# Altium schematic sheet F280025C_min_sys.SchDoc
size A3; SheetNumber: 1; SheetTotal: 2
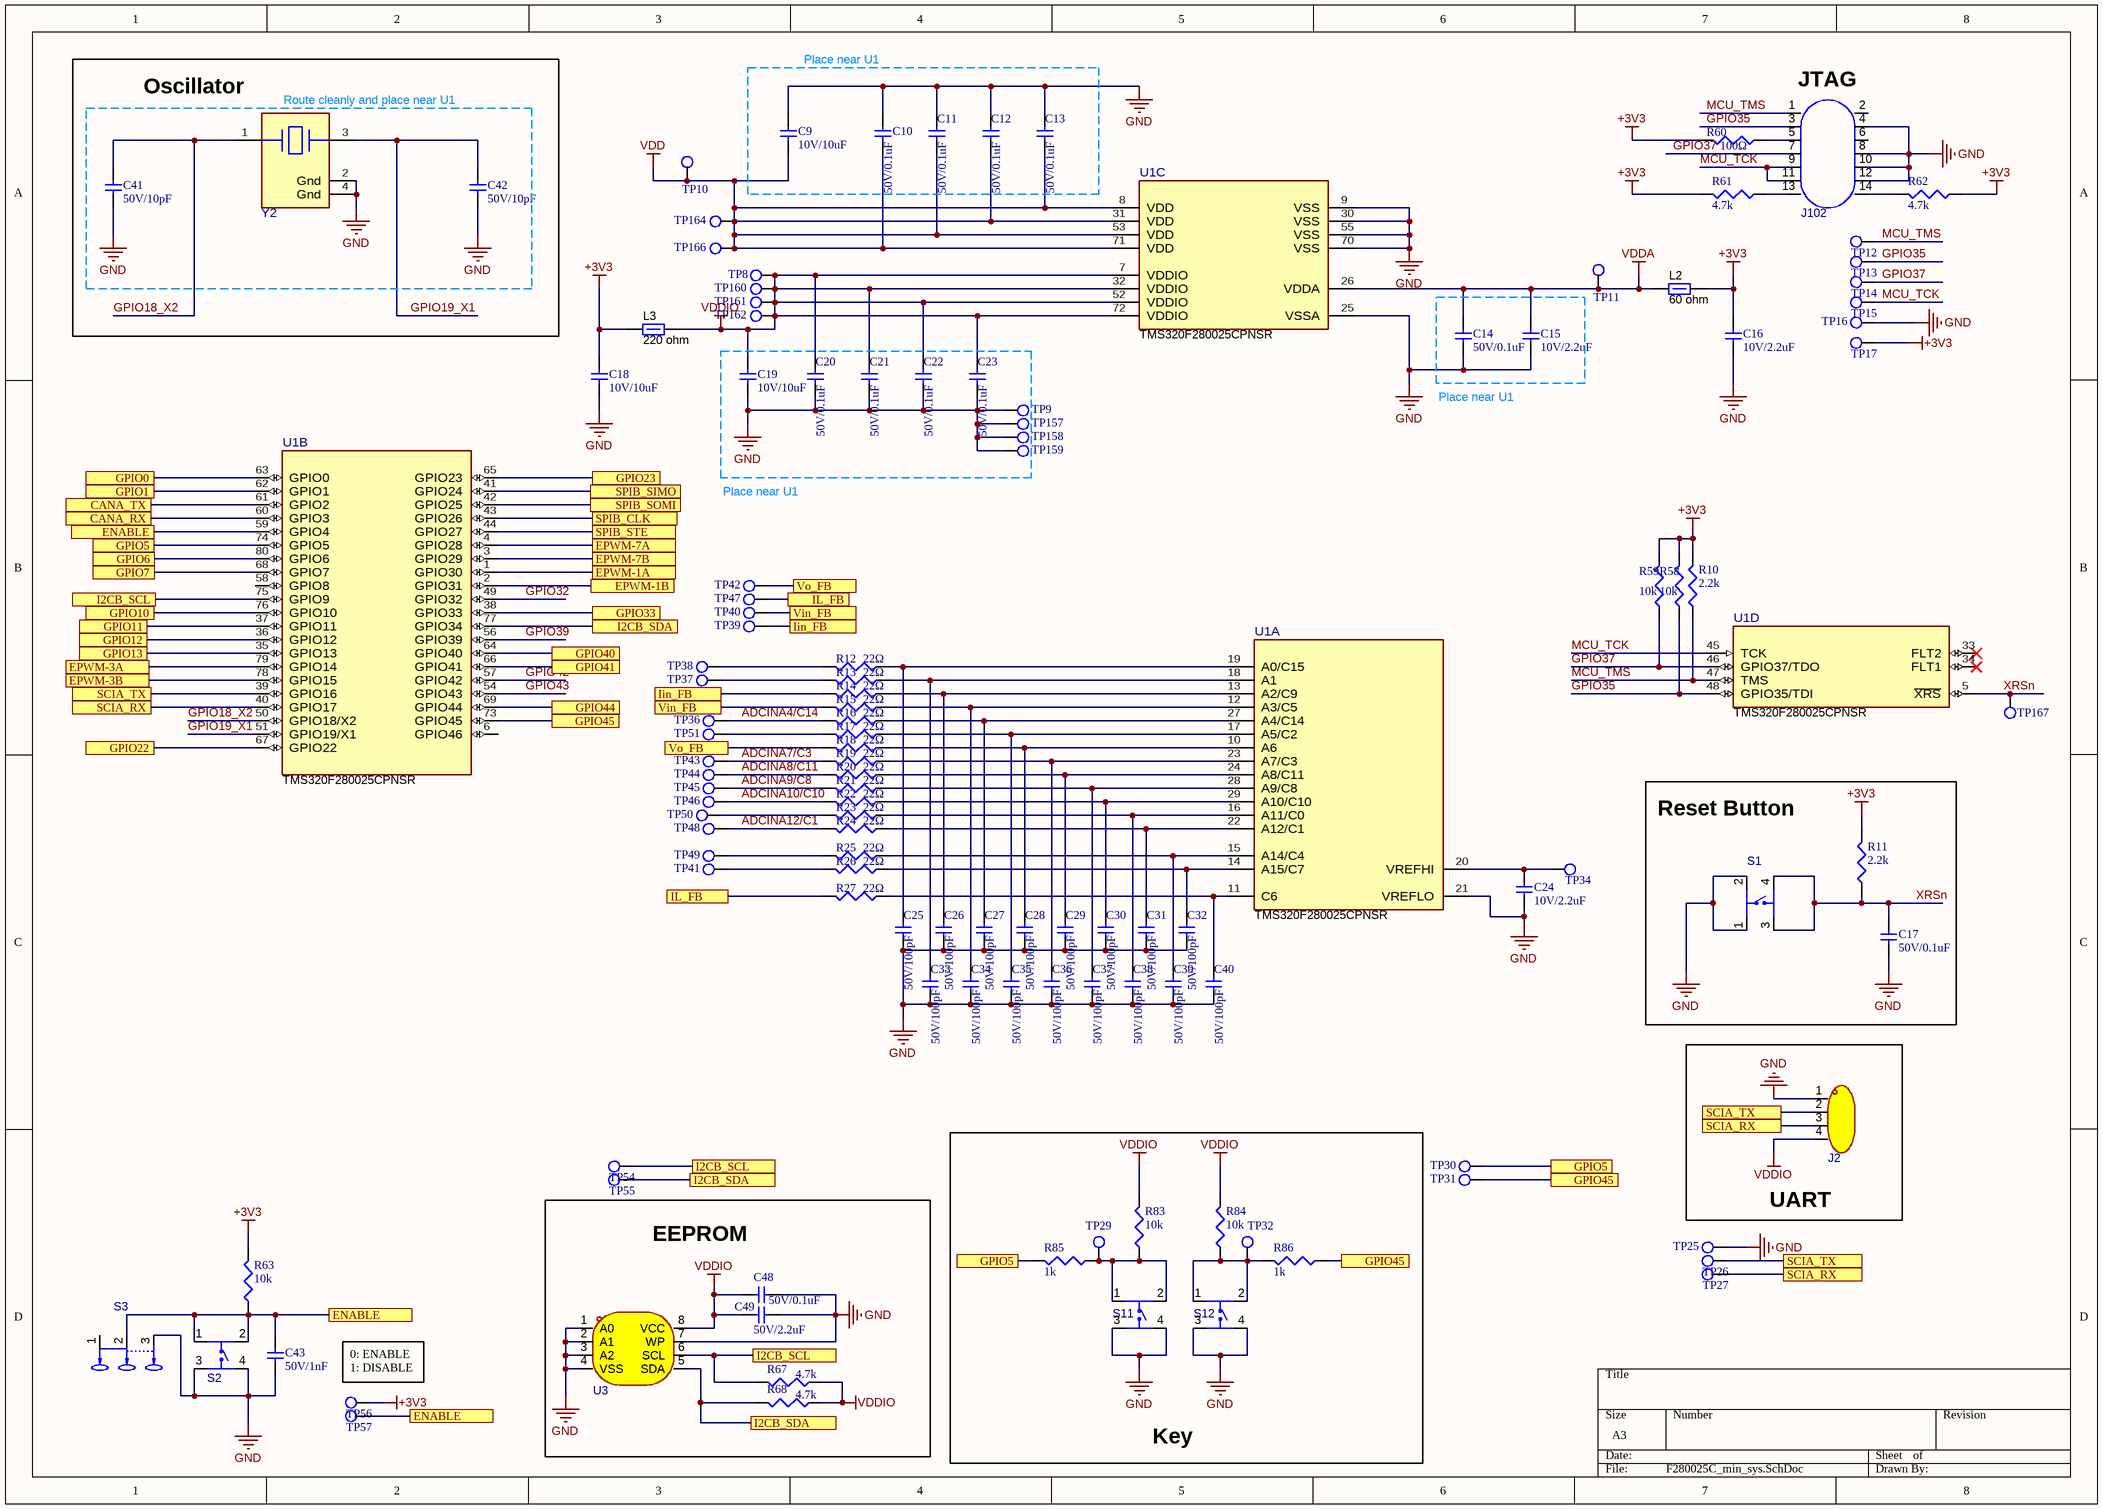
[diagram p0: F280025C_min_sys.SchDoc]

## Parts
C9  10V/10uF  [C0603]
C10  50V/0.1uF  [C0603]
C11  50V/0.1uF  [C0603]
C12  50V/0.1uF  [C0603]
C13  50V/0.1uF  [C0603]
C14  50V/0.1uF  [C0603]
C15  10V/2.2uF  [C0603]
C16  10V/2.2uF  [C0603]
C17  50V/0.1uF  [C0603]
C18  10V/10uF  [C0603]
C19  10V/10uF  [C0603]
C20  50V/0.1uF  [C0603]
C21  50V/0.1uF  [C0603]
C22  50V/0.1uF  [C0603]
C23  50V/0.1uF  [C0603]
C24  10V/2.2uF  [C0603]
C25  50V/100pF  [C0603]
C26  50V/100pF  [C0603]
C27  50V/100pF  [C0603]
C28  50V/100pF  [C0603]
C29  50V/100pF  [C0603]
C30  50V/100pF  [C0603]
C31  50V/100pF  [C0603]
C32  50V/100pF  [C0603]
C33  50V/100pF  [C0603]
C34  50V/100pF  [C0603]
C35  50V/100pF  [C0603]
C36  50V/100pF  [C0603]
C37  50V/100pF  [C0603]
C38  50V/100pF  [C0603]
C39  50V/100pF  [C0603]
C40  50V/100pF  [C0603]
C41  50V/10pF  [C0603]
C42  50V/10pF  [C0603]
C43  50V/1nF  [C0603]
C48  50V/0.1uF  [C0603]
C49  50V/2.2uF  [C0805]
J2  pz254v-11-04p  [HDR-TH_4P-P2.54-V-M]  (value not drawn)
J102  2.54-2*7p简牛  [IDC-TH_14P-P2.54-V-R2-C7-S2.54]  (value not drawn)
L2  value 60 ohm  [L0805]  (hidden comment: 60Ω@100MHz)
L3  ValueDisplayed: 220 ohm  [L0805]  (hidden comment: 220Ω/100 MHz)
R10  2.2k  [R0603]
R11  2.2k  [R0603]
R12  22Ω  [R0603]
R13  22Ω  [R0603]
R14  22Ω  [R0603]
R15  22Ω  [R0603]
R16  22Ω  [R0603]
R17  22Ω  [R0603]
R18  22Ω  [R0603]
R19  22Ω  [R0603]
R20  22Ω  [R0603]
R21  22Ω  [R0603]
R22  22Ω  [R0603]
R23  22Ω  [R0603]
R24  22Ω  [R0603]
R25  22Ω  [R0603]
R26  22Ω  [R0603]
R27  22Ω  [R0603]
R58  10k  [R0603]
R59  10k  [R0603]
R60  100Ω  [R0603]
R61  4.7k  [R0603]
R62  4.7k  [R0603]
R63  10k  [R0603]
R67  4.7k  [R0603]
R68  4.7k  [R0603]
R83  10k  [R0603]
R84  10k  [R0603]
R85  1k  [R0603]
R86  1k  [R0603]
S1  kh-6x6x5h-stm  [SW-SMD_4P-L6.0-W6.0-P4.50-LS9.0_H5.0]  (value not drawn)
S2  kh-6x6x5h-stm  [SW-SMD_4P-L6.0-W6.0-P4.50-LS9.0_H5.0]  (value not drawn)
S3  ss-12d10l5  [SW-TH_SS-12D10L5]  (value not drawn)
S11  kh-6x6x5h-stm  [SW-SMD_4P-L6.0-W6.0-P4.50-LS9.0_H5.0]  (value not drawn)
S12  kh-6x6x5h-stm  [SW-SMD_4P-L6.0-W6.0-P4.50-LS9.0_H5.0]  (value not drawn)
TP8  TEST POINT  [TP-1.5]  (value not drawn)
TP9  TP-pad0.8  [PAD0.8/1.6]  (value not drawn)
TP10  TEST POINT  [TP-1.5]  (value not drawn)
TP11  TEST POINT  [TP-1.5]  (value not drawn)
TP12  TEST POINT  [TP-1.5]  (value not drawn)
TP13  TEST POINT  [TP-1.5]  (value not drawn)
TP14  TEST POINT  [TP-1.5]  (value not drawn)
TP15  TEST POINT  [TP-1.5]  (value not drawn)
TP16  TP-pad0.8  [PAD0.8/1.6]  (value not drawn)
TP17  TEST POINT  [TP-1.5]  (value not drawn)
TP25  TP-pad0.8  [PAD0.8/1.6]  (value not drawn)
TP26  TEST POINT  [TP-1.5]  (value not drawn)
TP27  TEST POINT  [TP-1.5]  (value not drawn)
TP29  TEST POINT  [TP-1.5]  (value not drawn)
TP30  TEST POINT  [TP-1.5]  (value not drawn)
TP31  TEST POINT  [TP-1.5]  (value not drawn)
TP32  TEST POINT  [TP-1.5]  (value not drawn)
TP34  TEST POINT  [TP-1.5]  (value not drawn)
TP36  TP-pad0.8  [PAD0.8/1.6]  (value not drawn)
TP37  TP-pad0.8  [PAD0.8/1.6]  (value not drawn)
TP38  TP-pad0.8  [PAD0.8/1.6]  (value not drawn)
TP39  TP-pad0.8  [PAD0.8/1.6]  (value not drawn)
TP40  TP-pad0.8  [PAD0.8/1.6]  (value not drawn)
TP41  TP-pad0.8  [PAD0.8/1.6]  (value not drawn)
TP42  TP-pad0.8  [PAD0.8/1.6]  (value not drawn)
TP43  TP-pad0.8  [PAD0.8/1.6]  (value not drawn)
TP44  TP-pad0.8  [PAD0.8/1.6]  (value not drawn)
TP45  TP-pad0.8  [PAD0.8/1.6]  (value not drawn)
TP46  TP-pad0.8  [PAD0.8/1.6]  (value not drawn)
TP47  TP-pad0.8  [PAD0.8/1.6]  (value not drawn)
TP48  TP-pad0.8  [PAD0.8/1.6]  (value not drawn)
TP49  TP-pad0.8  [PAD0.8/1.6]  (value not drawn)
TP50  TP-pad0.8  [PAD0.8/1.6]  (value not drawn)
TP51  TP-pad0.8  [PAD0.8/1.6]  (value not drawn)
TP54  TEST POINT  [TP-1.5]  (value not drawn)
TP55  TEST POINT  [TP-1.5]  (value not drawn)
TP56  TEST POINT  [TP-1.5]  (value not drawn)
TP57  TEST POINT  [TP-1.5]  (value not drawn)
TP157  TP-pad0.8  [PAD0.8/1.6]  (value not drawn)
TP158  TP-pad0.8  [PAD0.8/1.6]  (value not drawn)
TP159  TP-pad0.8  [PAD0.8/1.6]  (value not drawn)
TP160  TEST POINT  [TP-1.5]  (value not drawn)
TP161  TEST POINT  [TP-1.5]  (value not drawn)
TP162  TEST POINT  [TP-1.5]  (value not drawn)
TP164  TEST POINT  [TP-1.5]  (value not drawn)
TP166  TEST POINT  [TP-1.5]  (value not drawn)
TP167  TEST POINT  [TP-1.5]  (value not drawn)
U1  TMS320F280025CPNSR  [PN0080A-MFG]  (parts A,B,C,D of 4)
U3  24lc64t-i/sn  [SOIC-8_L4.9-W3.9-P1.27-LS6.0-BL]  (value not drawn)
Y2  20M  [CRYSTAL-SMD_4P-L3.2-W2.5-BL-2]  (value not drawn)

## Blocks framed on the sheet
Oscillator: C41 C42 Y2
Reset Button: C17 R11 S1
UART: J2
Key: R83-R86 S11 S12 TP29 TP32
EEPROM: C48 C49 R67 R68 U3

## Ports
CANA_RX, CANA_TX, ENABLE, EPWM-1A, EPWM-1B, EPWM-3A, EPWM-3B, EPWM-7A, EPWM-7B, GPIO0, GPIO1, GPIO5, GPIO6, GPIO7, GPIO10, GPIO11, GPIO12, GPIO13, GPIO22, GPIO23, GPIO33, GPIO40, GPIO41, GPIO44, GPIO45, I2CB_SCL, I2CB_SDA, Iin_FB, IL_FB, SCIA_RX, SCIA_TX, SPIB_CLK, SPIB_SIMO, SPIB_SOMI, SPIB_STE, Vin_FB, Vo_FB

## Nets
+3V3: C16.1 C18.1 L2.2 L3.1 R10.2 R11.2 R58.2 R59.2 R60.2 R61.2 R62.1 R63.2 TP17.1 TP56.1
GND: C9.1 C10.1 C11.1 C12.1 C13.1 C14.2 C15.2 C16.2 C17.2 C18.2 C19.2 C20.2 C21.2 C22.2 C23.2 C24.2 C25.2 C26.2 C27.2 C28.2 C29.2 C30.2 C31.2 C32.2 C33.2 C34.2 C35.2 C36.2 C37.2 C38.2 C39.2 C40.2 C41.2 C42.2 C43.2 C48.2 C49.2 J2.1 J102.4 J102.8 J102.10 J102.12 S1.1 S1.2 S2.3 S2.4 S3.3 S11.3 S11.4 S12.3 S12.4 TP9.1 TP16.1 TP25.1 TP157.1 TP158.1 TP159.1 U1.9(VSS) U1.21(VREFLO) U1.25(VSSA) U1.30(VSS) U1.55(VSS) U1.70(VSS) U3.1(A0) U3.2(A1) U3.3(A2) U3.4(VSS) U3.7(WP) Y2.2(Gnd) Y2.4(Gnd)
VDD: C9.2 C10.2 C11.2 C12.2 C13.2 TP10.1 TP164.1 TP166.1 U1.8(VDD) U1.31(VDD) U1.53(VDD) U1.71(VDD)
VDDA: C14.1 C15.1 L2.1 TP11.1 U1.26(VDDA)
VDDIO: C19.1 C20.1 C21.1 C22.1 C23.1 C48.1 C49.1 J2.4 L3.2 R67.1 R68.1 R83.2 R84.2 TP8.1 TP160.1 TP161.1 TP162.1 U1.7(VDDIO) U1.32(VDDIO) U1.52(VDDIO) U1.72(VDDIO) U3.8(VCC)
ADCINA4/C14: R16.2 TP36.1
ADCINA7/C3: R19.2 TP43.1
ADCINA8/C11: R20.2 TP44.1
ADCINA9/C8: R21.2 TP45.1
ADCINA10/C10: R22.2 TP46.1
ADCINA12/C1: R24.2 TP48.1
CANA_RX: U1.60(GPIO3) ; port CANA_RX
CANA_TX: U1.61(GPIO2) ; port CANA_TX
ENABLE: C43.1 R63.1 S2.1 S2.2 S3.2 TP57.1 U1.59(GPIO4) ; port ENABLE
EPWM-1A: U1.1(GPIO30) ; port EPWM-1A
EPWM-1B: U1.2(GPIO31) ; port EPWM-1B
EPWM-3A: U1.79(GPIO14) ; port EPWM-3A
EPWM-3B: U1.78(GPIO15) ; port EPWM-3B
EPWM-7A: U1.4(GPIO28) ; port EPWM-7A
EPWM-7B: U1.3(GPIO29) ; port EPWM-7B
GPIO0: U1.63(GPIO0) ; port GPIO0
GPIO1: U1.62(GPIO1) ; port GPIO1
GPIO5: R85.2 TP30.1 U1.74(GPIO5) ; port GPIO5
GPIO6: U1.80(GPIO6) ; port GPIO6
GPIO7: U1.68(GPIO7) ; port GPIO7
GPIO10: U1.76(GPIO10) ; port GPIO10
GPIO11: U1.37(GPIO11) ; port GPIO11
GPIO12: U1.36(GPIO12) ; port GPIO12
GPIO13: U1.35(GPIO13) ; port GPIO13
GPIO18_X2: C41.1 U1.50(GPIO18/X2) Y2.1(In/Out)
GPIO19_X1: C42.1 U1.51(GPIO19/X1) Y2.3(Out/In)
GPIO22: U1.67(GPIO22) ; port GPIO22
GPIO23: U1.65(GPIO23) ; port GPIO23
GPIO32: U1.49(GPIO32)
GPIO33: U1.38(GPIO33) ; port GPIO33
GPIO35: J102.3 R58.1 TP13.1 U1.48(GPIO35/TDI)
GPIO37: J102.7 R59.1 TP14.1 U1.46(GPIO37/TDO)
GPIO39: U1.56(GPIO39)
GPIO40: U1.64(GPIO40) ; port GPIO40
GPIO41: U1.66(GPIO41) ; port GPIO41
GPIO42: U1.57(GPIO42)
GPIO43: U1.54(GPIO43)
GPIO44: U1.69(GPIO44) ; port GPIO44
GPIO45: R86.1 TP31.1 U1.73(GPIO45) ; port GPIO45
I2CB_SCL: R67.2 TP54.1 U1.75(GPIO9) U3.6(SCL) ; port I2CB_SCL
I2CB_SDA: R68.2 TP55.1 U1.77(GPIO34) U3.5(SDA) ; port I2CB_SDA
Iin_FB: R14.2 TP39.1 ; port Iin_FB
IL_FB: R27.2 TP47.1 ; port IL_FB
MCU_TCK: J102.9 J102.11 TP15.1 U1.45(TCK)
MCU_TMS: J102.1 R10.1 TP12.1 U1.47(TMS)
SCIA_RX: J2.3 TP27.1 U1.40(GPIO17) ; port SCIA_RX
SCIA_TX: J2.2 TP26.1 U1.39(GPIO16) ; port SCIA_TX
SPIB_CLK: U1.43(GPIO26) ; port SPIB_CLK
SPIB_SIMO: U1.41(GPIO24) ; port SPIB_SIMO
SPIB_SOMI: U1.42(GPIO25) ; port SPIB_SOMI
SPIB_STE: U1.44(GPIO27) ; port SPIB_STE
Vin_FB: R15.2 TP40.1 ; port Vin_FB
Vo_FB: R18.2 TP42.1 ; port Vo_FB
XRSn: C17.1 R11.1 S1.3 S1.4 TP167.1 U1.5(~{XRS})
NetC24_1: C24.1 TP34.1 U1.20(VREFHI)
NetC25_1: C25.1 R12.1 U1.19(A0/C15)
NetC26_1: C26.1 R14.1 U1.13(A2/C9)
NetC27_1: C27.1 R16.1 U1.27(A4/C14)
NetC28_1: C28.1 R18.1 U1.10(A6)
NetC29_1: C29.1 R20.1 U1.24(A8/C11)
NetC30_1: C30.1 R22.1 U1.29(A10/C10)
NetC31_1: C31.1 R24.1 U1.22(A12/C1)
NetC32_1: C32.1 R26.1 U1.14(A15/C7)
NetC33_1: C33.1 R13.1 U1.18(A1)
NetC34_1: C34.1 R15.1 U1.12(A3/C5)
NetC35_1: C35.1 R17.1 U1.17(A5/C2)
NetC36_1: C36.1 R19.1 U1.23(A7/C3)
NetC37_1: C37.1 R21.1 U1.28(A9/C8)
NetC38_1: C38.1 R23.1 U1.16(A11/C0)
NetC39_1: C39.1 R25.1 U1.15(A14/C4)
NetC40_1: C40.1 R27.1 U1.11(C6)
NetJ102_5: J102.5 R60.1
NetJ102_13: J102.13 R61.1
NetJ102_14: J102.14 R62.2
NetR12_2: R12.2 TP38.1
NetR13_2: R13.2 TP37.1
NetR17_2: R17.2 TP51.1
NetR23_2: R23.2 TP50.1
NetR25_2: R25.2 TP49.1
NetR26_2: R26.2 TP41.1
NetR83_1: R83.1 R85.1 S11.1 S11.2 TP29.1
NetR84_1: R84.1 R86.2 S12.1 S12.2 TP32.1

Not connected (* = marked no-connect by the designer): J102 2 6; S3 1; U1 6(GPIO46) 33(FLT2)* 34(FLT1)* 58(GPIO8)

## Notes on the sheet
- (near Y2) Route cleanly and place near U1
- Place near U1
- (near J102) JTAG
- 0: ENABLE
- 1: DISABLE

## Library data of the parts
C9 C18 C19 = C0603-10V/10uF: 0603,10V/10uF
C10-C14 C17 C20-C23 C48 = C0603-50V/104: 0603,50V/104
C15 C16 C24 = C0603-10V/2.2uF: 0603,10V/2.2uF
C25-C40 = C0603-50V/100pF: 0603,50V/100pF
C41 C42 = C0603-50V/10pF: 0603,50V/10pF,C0G/NP0
C43 = C0603-50V/1nF: 0603,50V/1nF
C49 = C0805-50V/2.2uF: 0805,50V/2.2uF,
J2 = pz254v-11-04p: 插针结构:1x4P;间距:2.54mm;行距:-;圆针/方针:方针;安装方式:直插;排数:单排;总PIN位数:4P;额定电流:3A;额定电压:250V;配合针长度:6mm;塑高:2.5mm;端接针长度:3mm;触头材质:-;工作温度:-40℃~+105℃;颜色:黑色;; Manufacturer: XFCN(兴飞); Symbol: PZ254V-11-04P_C2691448; AddInBom: yes; ModelId: 112f4d05e8d64e99ab9a333894bea4f9; ModelName: HDR-TH_4P-P2.54-M-LI-1X4P; ModelTransform: 399.999,104.7242,0,0,0,0,0,0,-118.11; Pin Structure: 1x4P; Pitch: 2.54mm; Circluar Pins/Square Pins: 方针; Current Rating: 3A; Voltage Rating (Max): 250V; LCSC Part Name: 1x4P 间距:2.54mm 方针 直插; SupplierPart: C2691448; ManufacturerPart: PZ254V-11-04P; Supplier Footprint: 插件,P=2.54mm; JLCPCB Part Class: Extended Part; Datasheet: https://item.szlcsc.com/datasheet/PZ254V-11-04P/2801085.html; Supplier: LCSC; ConvertToPcb: yes; FootprintName: HDR-TH_4P-P2.54-V-M; Row Spacing: -; Mounting Type: 直插; Number of Rows: 单排; Number of Pins: 4P; Length of Mating Pin: 6mm; Insulation Height: 2.5mm; Length of End Connection Pin: 3mm; Contact Material: -; Operating Temperature: -40℃~+105℃; Color: 黑色
J102 = 2.54-2*7p简牛: 连接器类型:简牛座;间距:2.54mm;结构:2x7P;安装方式:直插;行距:2.54mm;排数:2;每排PIN数:7;触头材质:黄铜;触头镀层:金;; Manufacturer: BOOMELE(博穆精密); Symbol: HDR-IDC-2.54-2X7P; AddInBom: yes; ModelId: 1e191473481d43b08e40c7df32061c8c; ModelTransform: 999.998,348.41478,0,0,0,0,0,3.937,-118.11; Connector Type: 简牛座; Pitch: 2.54mm; Number of Positions or Pins: 2x7P; Holder Type: 直插; Number of PINs Per Row: 7; LCSC Part Name: 2.54mm 2x7P 排数:2 每排P数:7; SupplierPart: C11215; ManufacturerPart: 2.54-2*7P简牛; Supplier Footprint: 插件,P=2.54mm; JLCPCB Part Class: Extended Part; Datasheet: https://item.szlcsc.com/datasheet/2.54-2*7P%25E7%25AE%2580%25E7%2589%259B/11764.html; Supplier: LCSC; ConvertToPcb: yes; FootprintName: IDC-TH_14P-P2.54-V-R2-C7-S2.54; ModelName: IDC-TH_14P-P2.54-V-R2-C7-S2.54; Row Spacing: 2.54mm; Number of Rows: 2; Contact Material: 黄铜; Contact Plating: 金
L2 = 磁珠-60Ω@100MHz: 磁珠,60Ω@100MHz,3A,0805,CBW201209U600T,风华; Manufacturer: Wurth Elektronik; PartNumber: 742792063; Ztyp@1GHz_Ohm: 95.384; ZTyp@100MHz_Ohm: 60; SizeAreaWB_mm2: 6.75; DCR_ohm: 0.025; Value1: 0.025 ohm; SizeZ_mm: 1.45; SizeX_mm: 2; SizeY_mm: 1.25; SizeArea_mm2: 2.5; CompType: Ferrite Bead; ComponentLink1URL: http://katalog.we-online.de/pbs/datasheet/742792063.pdf; Supplier Part Number 2: 710-742792063; Publisher: Texas Instruments; Supplier 2: Mouser; Published: 2014-04-30; RoHS: Y; MountType: SMT; Supplier 1: Digi-Key; PackageReference: 0805; Imax_A: 3A; Value2: 3A; LatestRevisionDate: 2017-03-09; ComponentLink1Description: Datasheet link; Supplier Part Number 1: 732-1612-1-ND; ValueDisplayed: 60 ohm
L3 = 磁珠-220Ω-100MHz-2A: 磁珠 220Ω @ 100 MHz, 2 A, 0805,BLM21PG221SN1D，村田; Manufacturer: Wurth Elektronik; PartNumber: 742792022; Ztyp@1GHz_Ohm: 190.289; ZTyp@100MHz_Ohm: 220; SizeAreaWB_mm2: 6.75; DCR_ohm: 0.05; Value1: 0.05 ohm; Value: 220 ohm; Imax_A: 2A; SizeZ_mm: 1.45; SizeX_mm: 2; SizeY_mm: 1.25; SizeArea_mm2: 2.5; CompType: Ferrite Bead; ComponentLink1URL: http://katalog.we-online.de/pbs/datasheet/742792022.pdf; Supplier Part Number 2: 710-742792022; Publisher: Texas Instruments; Supplier 2: Mouser; Published: 2014-04-30; RoHS: Y; MountType: SMT; Supplier 1: Digi-Key; PackageReference: 0805; Value2: 2A; LatestRevisionDate: 2017-03-09; ComponentLink1Description: Datasheet link; Supplier Part Number 1: 732-1614-1-ND
R10 R11 = R0603-2.2k: 0603,2.2k
R12-R27 = R0603-22Ω: 0603,22Ω
R58 R59 R63 R83 R84 = R0603-10k: 0603,10k
R60 = R0603-100Ω: 0603,100Ω
R61 R62 R67 R68 = R0603-4.7k: 0603,4.7k
R85 R86 = R0603-1k: 0603,1k
S1 S2 S11 S12 = kh-6x6x5h-stm: 电路结构:单刀单掷;按钮形状:圆形按钮;安装方式:立贴;开关长度:6mm;开关宽度:6mm;开关高度:5mm;带支架:不带支架;触点电流:50mA;额定电压:12V;工作寿命:8万次;; Manufacturer: kinghelm(金航标); AddInBom: yes; ModelId: 46371efb35684031937580a0045530ec; ModelTransform: 354.33,236.25937,0,0,0,0,0,0,0; Circuit: 单刀单掷; Actuator Style: 圆形按钮; Switch Height: 5mm; with Bracket: 不带支架; Contact Current: 50mA; Voltage Rating: 12V; Actuator/Cap Color: 黑色; Life: 8万次; Symbol: KH-6X6X5H-STM; LCSC Part Name: 6*6*5mm 立贴 轻触开关; SupplierPart: C2837531; ManufacturerPart: KH-6X6X5H-STM; Supplier Footprint: SMD-4P,6x6mm; JLCPCB Part Class: Extended Part; Datasheet: https://item.szlcsc.com/datasheet/KH-6X6X5H-STM/3009601.html; Supplier: LCSC; ConvertToPcb: yes; FootprintName: SW-SMD_4P-L6.0-W6.0-P4.50-LS9.0_H5.0; ModelName: SW-SMD_4P-L6.0-W6.0-P4.50-LS9.0_H5.0; Mounting Type: 立贴; Length: 6mm; Width: 6mm; Termination Style: 鸥翼型
S3 = ss-12d10l5: 电路结构:单刀双掷;安装方式:直插;开关颜色:黑色;额定电流:3A;额定电压:125V;工作寿命:1万次;; Manufacturer: XKB Connection(中国星坤); AddInBom: yes; ModelId: c49f07a32c154ec8ad7cf47670a53981; ModelName: SW-TH_L13.0-W6.8-H6.4-P4.7; ModelTransform: 511.81394,267.716,0,0,0,0,0,0,-220.472; Circuit: 单刀双掷; Actuator Style: 矩形柱状; Switch Height: 6.4mm; Actuator Color: 黑色; Current Rating: 3A; Voltage Rating: 125V; Life: 1万次; Symbol: SS-12D10L5; LCSC Part Name: 柄长5mm 直插双档 滑动开关; SupplierPart: C319012; ManufacturerPart: SS-12D10L5; Supplier Footprint: 插件,13x6.8mm; JLCPCB Part Class: Extended Part; Datasheet: https://item.szlcsc.com/datasheet/SS-12D10L5/300104.html; Supplier: LCSC; ConvertToPcb: yes; FootprintName: SW-TH_SS-12D10L5; Termination Style: PC引脚; Length: 13mm; Width: 6.8mm; Mounting Type: 直插; Operating Temperature: -40℃~+85℃
U1 = SYM-TMS320F280025CPNSR: 32-bit MCU with 100 MHz, FPU, TMU, 128-KB flash, CLB 80-LQFP -40 to 125; Manufacturer: Texas Instruments; TJmax_C: +125°C; Number Of Spi Channels: 2; CompType: IC; Max Supply Voltage: 3.63V; Number Of Pwm Channels: 14; AEC Qualified: No; Memory Size: 128KBytes; Interface: I2C,SPI,UART,CAN,LIN,SCI,Other; Min Supply Voltage: 2.8V; SizeZ_mm: 1.6mm; Number Of Adc Channels: 16; Number Of Timers/Counters: 3; Ram Size: 24KBytes; Number Of Cores: 1; Frequency_Fixed: 100MHz; Number Of I/Os: 43; Data Bus Width: 32bits; Standoff Height: 0.05mm; Core Architecture: TMS320C28x; AEC Category: Q200; TaMin_C: -40°C; Number Of A/D Converters: 2; helpURL: https://upverter.com/upn/revision/e6f10be0003e77e0/; ComponentLink3Description: Online Datasheet; Memory Type: FLASH; ComponentLink3URL: http://www.ti.com/product/GPN/datasheet; ComponentLink1Description: Datasheet Link; ComponentLink2Description: Product Folder; Operating Temperature Range: -40°C to +125°C; Datasheet Path: datasheets/IC-TMS320F280025CPNSR.pdf; Number Of Uart Channels: 1; RoHS: UNKNOWN; Number Of I2C Channels: 2; TaMax_C: +125°C; PackageReference: LQFP80; Part Number: TMS320F280025CPNSR; ComponentLink1URL: http://www.ti.com/lit/ds/symlink/GPN.pdf; ComponentLink2URL: http://www.ti.com/product/GPN; PartId: 1; PartNumber: TMS320F280025CPNSR
U3 = 24lc64t-i/sn: 接口类型:I2C;存储容量:64Kbit;时钟频率(fc):400kHz;; Manufacturer: MICROCHIP(美国微芯); Symbol: 24LC64T-I/SN SOP-8; AddInBom: yes; ModelId: e81d2f7d937b4a6ab1dca543ff5d56a4; ModelName: SOIC-8_L4.9-W3.9-H1.7-LS6.0-P1.27; ModelTransform: 192.913,236.22,0,0,0,0,0,0,0; Interface: I2C; Memory Size: 64Kbit; Clock Frequency: 400kHz; Write Cycle Time(Tw): 5ms; Data Retention - TDR (Year): 200年; Write Cycle Endurance: 100万次; Voltage - Supply: 2.5V~5.5V; LCSC Part Name: 64K I²C 串行 EEPROM; SupplierPart: C5460; ManufacturerPart: 24LC64T-I/SN; Supplier Footprint: SOIC-8; JLCPCB Part Class: Extended Part; Datasheet: https://item.szlcsc.com/datasheet/24LC64T-I%252FSN/5911.html; Supplier: LCSC; ConvertToPcb: yes; FootprintName: SOIC-8_L4.9-W3.9-P1.27-LS6.0-BL; Features: 噪声抑制功能；硬件写保护功能; Operating Temperature: -40℃~+85℃
Y2 = 晶振-20M-X322520MSB4SI: 20M,X322520MSB4SI,扬兴,SMD3225-4P,常温频差:±10ppm;负载电容:20pF;频率稳定度:±20ppm;; PartNumber: ECS-200-8-30B-CKM; Manufacturer: ECS International; Tolerance_%: 10ppm; Frequency_Fixed: 20MHz; Esr: 40; AEC Qualified: No; Load Capacitance: 8pF; SizeZ_mm: 0.85mm; Datasheet Path: datasheets/Crys-ECS-200-8-30B-CKM.pdf; ComponentLink1URL: https://ecsxtal.com/store/pdf/ecx_53b.pdf; Supplier Part Number 1: XC1841CT-ND; Operating Temperature Range: -20°C to +70°C; PackageReference: SMD4; Mouser Part Number: 520-200-8-30B-CKM; ComponentLink1Description: Datasheet; Part Number: ECS-200-8-30B-CKM; Digikey Description: CRYSTAL 20.0000MHZ 8PF SMD; Supplier 2: Mouser; Mouser Description: Crystals 20.000MHZ 8pF 10ppm -20C +70C; Supplier 1: Digikey; Frequency Stability: 10ppm; datasheet: https://ecsxtal.com/store/pdf/ecx_53b.pdf; Frequency Tolerance: 10ppm; Digikey Part Number: XC1841CT-ND; Lead Free: Yes; helpURL: https://upverter.com/upn/revision/b9ae4a09c701963d/; RoHS: TRUE; Series: ECX-53B; Supplier Part Number 2: 520-200-8-30B-CKM